# EAGLE design FT232 USB to TTL Converter (EAGLE 9.6.2)
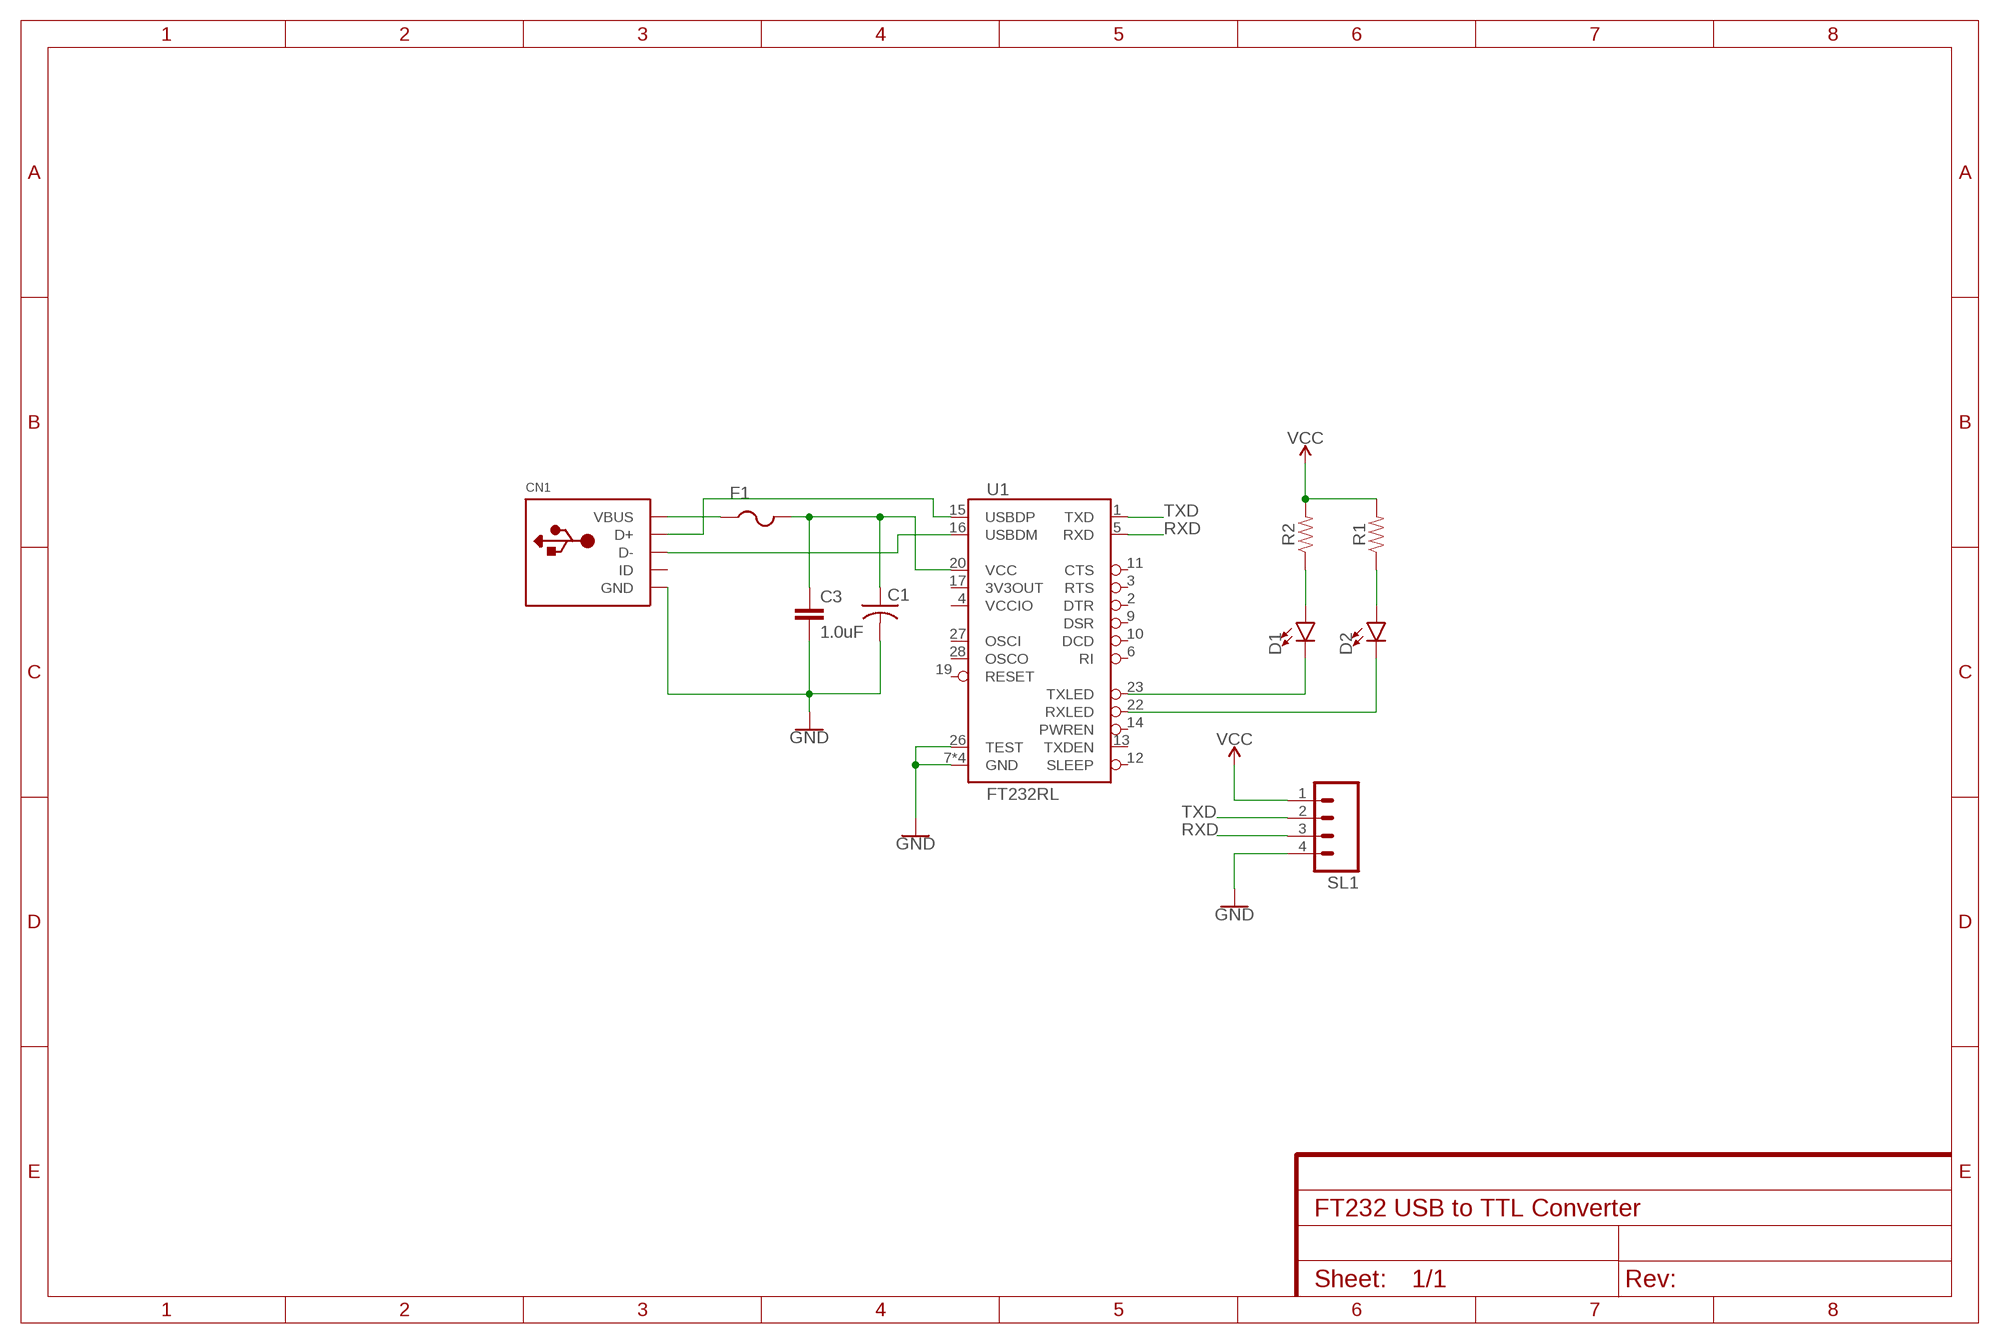
[diagram p0: schematic, sheet 1]

## Parts
C1  C-USC1206  [C1206]
C3  1.0uF  1.0UF-1206-50V-10%  [1206]
CN1  USBMOLEX  [USB-MINIB-THM-MOLEX]
D1  LED1206  [LED-1206]
D2  LED1206  [LED-1206]
F1  PTCFUSE-1206  [R1206]
R1  RESISTOR1206  [1206]
R2  RESISTOR1206  [1206]
SL1  M04  [04P]
U1  FT232RL  FT232RLSSOP  [SSOP28DB]

## Nets
GND: C1.2 C3.2 CN1.GND SL1.4 U1.7(GND) U1.18(GND) U1.21(GND) U1.25(GND) U1.26(TEST)
N$1: CN1.VBUS F1.1
N$2: C1.1 C3.1 F1.2 U1.20(VCC)
N$3: CN1.D+ U1.15(USBDP)
N$4: CN1.D- U1.16(USBDM)
N$5: D1.A R2.1
N$6: D2.A R1.1
N$7: D1.C U1.23(TXLED)
N$8: D2.C U1.22(RXLED)
RXD: SL1.3 U1.5(RXD)
TXD: SL1.2 U1.1(TXD)
VCC: R1.2 R2.2 SL1.1
Unconnected: CN1.ID U1.2(DTR) U1.3(RTS) U1.6(RI) U1.9(DSR) U1.10(DCD) U1.11(CTS) U1.12(SLEEP) U1.13(TXDEN) U1.14(PWREN) U1.17(3V3OUT) U1.19(RESET) U1.27(OSCI) U1.28(OSCO)

## Power pins joined to a net without a drawn wire
VCCIO: U1.4(VCCIO)

## Library data of the parts
C1 = adafruit:C-US: CAPACITOR, American symbol
C3 = SparkFun-Capacitors:1.0UF: 1µF ceramic capacitors A capacitor is a passive two-terminal electrical component used to store electrical energy temporarily in an electric field.; PROD_ID: CAP-09822
CN1 = adafruit:USB: USB Connectors USBMINIB - Surface Mount Female Mini-B USB Connector 4UConnector: 06564 By microbuilder.eu Thru-hole RA Female Mini-B USB Connector 4UConnector: 18732 By ladyada.net
D1 D2 = SparkFun-LED:LED: LED (Generic) Standard schematic elements and footprints for 5mm, 3mm, 1206, and 0603 sized LEDs. Generic LEDs with no color specified.
F1 = adafruit:PTCFUSE: PTC fuses, resettable thermistors
R1 R2 = SparkFun-Resistors:RESISTOR: Generic Resistor Package
SL1 = con-amp-quick:M04: AMP QUICK CONNECTOR; OC_FARNELL: unknown; OC_NEWARK: unknown
U1 = SparkFun-IC-Comms:FT232RL: FT232RL USB UART FT232RL 4th Generation USB UART (USB <-> Serial) Controller. Datasheet <http://www.sparkfun.com/datasheets/IC/FT232R_v104.pdf> SparkFun Products Component <https://www.sparkfun.com/products/650> (COM-00650) SparkFun RedBot Mainboard <https://www.sparkfun.com/products/12097> (ROB-12097) SparkFun FTDI Basic Breakout - 5V <https://www.sparkfun.com/products/9716> (DEV-09716) SparkFun FTDI Basic Breakout - 3.3V <https://www.sparkfun.com/products/9873> (DEV-09873) Bus Pirate - v3.6a <https://www.sparkfun.com/products/12942> (TOL-12942) SparkFun USB to Serial Breakout - FT232RL <https://www.sparkfun.com/products/12731> (BOB-12731) SparkFun PicoBoard <https://www.sparkfun.com/products/11888> (WIG-11888) SparkFun RFID USB Reader <https://www.sparkfun.com/products/9963> (SEN-09963) LilyPad FTDI Basic Breakout - 5V <https://www.sparkfun.com/products/10275> (DEV-10275) SparkFun Stepoko <https://www.sparkfun.com/products/13899> (ROB-13899); PROD_ID: IC-00870

## Board
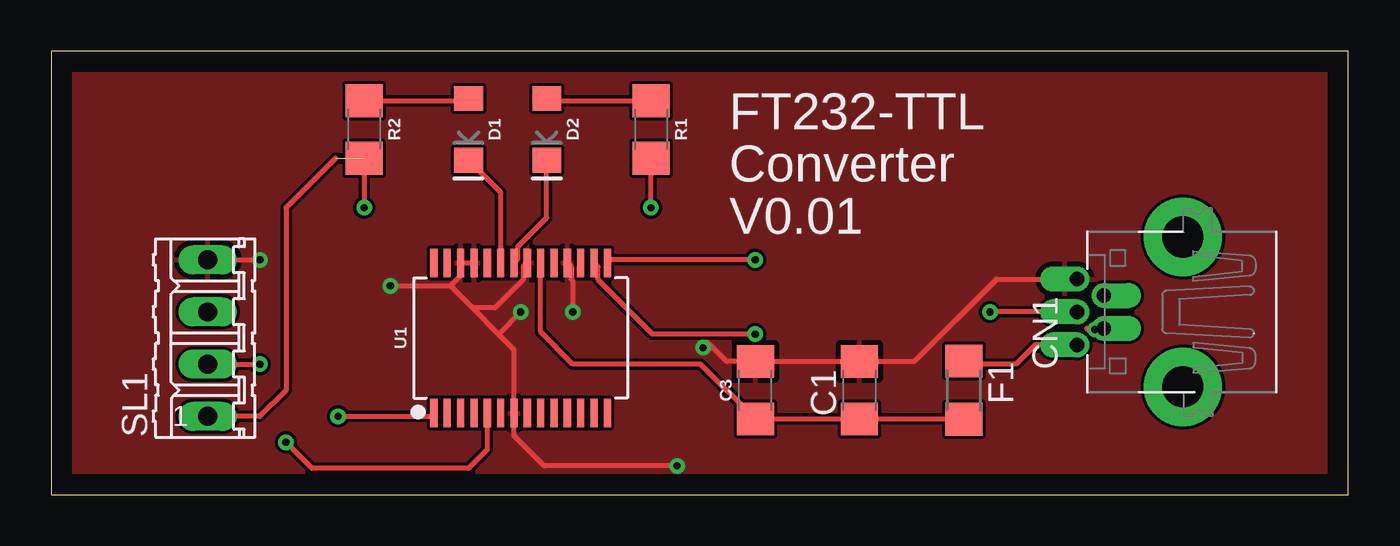
[diagram p1: board, top side]
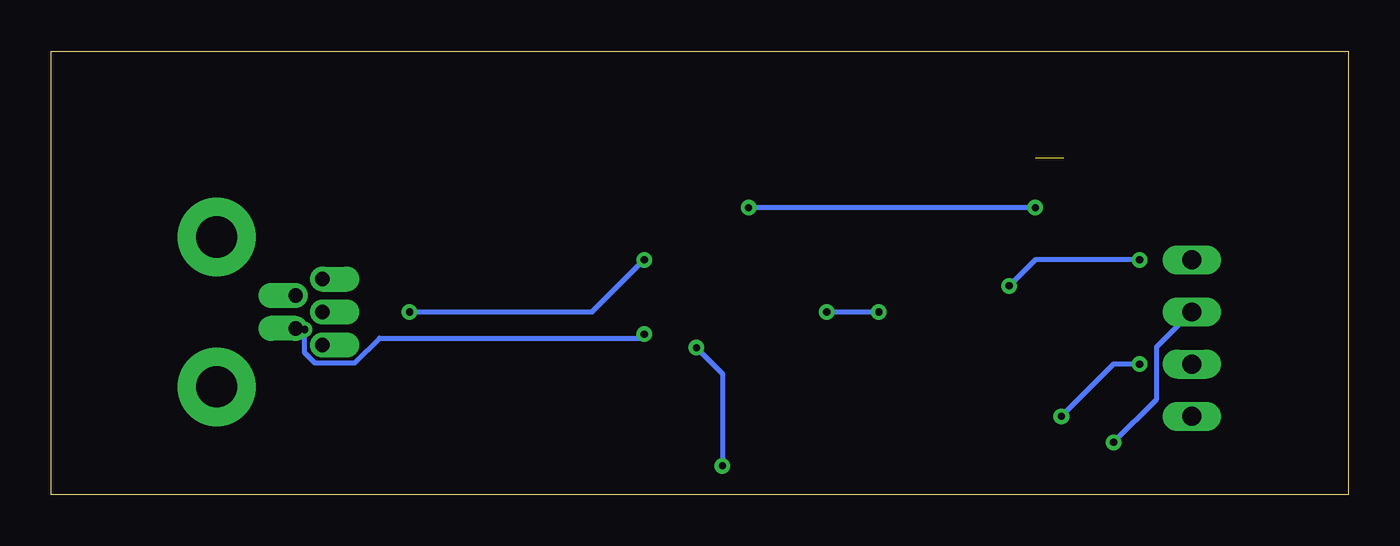
[diagram p2: board, bottom side, seen from below]

Size 63.17 x 21.58 mm. Coordinates in mm from the lower left corner, seen from the top.
Outline: 0,0 63.17,0 63.17,21.58 0,21.58 0,0
Copper layers (1*16): Top 0.035mm / dielectric 1.5mm / Bottom 0.035mm
Design rules "default": minimum track width 6mil, minimum drill 0.35mm, track to track 6mil, track to pad 6mil, pad to pad 6mil, via to via 6mil, smd to smd 6mil, copper to edge 40mil, drill to drill 6mil, minimum pad ring 10mil, minimum via ring 8mil, stop-mask expansion 4mil, vias tented up to drill 0mil, thermal gap 10mil

### Footprints (pad centres in the part's own frame; a part is rotated, then mirrored left to right if it is on the bottom)
C1206 = smd 1.6 x 1.8: 1 -1.4,0; 2 1.4,0
1206 = smd 1.6 x 1.8: 1 -1.4,0; 2 1.4,0
USB-MINIB-THM-MOLEX = drill 0.7 offset: D+ 0,9.72; D- -0.8,8.42; GND 1.6,9.72; ID 0.8,8.42; VBUS -1.6,9.72 | drill 2 pad 3.81: GND1 -3.65,4.57; GND4 3.65,4.57
LED-1206 = smd 1.2 x 1.4: A -1.5,0; C 1.5,0
R1206 = smd 1.6 x 1.803: 1 -1.422,0; 2 1.422,0
04P = drill 0.914 long: 1 -3.81,0; 2 -1.27,0; 3 1.27,0; 4 3.81,0
SSOP28DB = smd 0.348 x 1.397: 1 -4.225,-3.656; 2 -3.575,-3.656; 3 -2.925,-3.656; 4 -2.275,-3.656; 5 -1.625,-3.656; 6 -0.975,-3.656; 7 -0.325,-3.656; 8 0.325,-3.656; 9 0.975,-3.656; 10 1.625,-3.656; 11 2.275,-3.656; 12 2.925,-3.656; 13 3.575,-3.656; 14 4.225,-3.656; 15 4.225,3.656; 16 3.575,3.656; 17 2.925,3.656; 18 2.275,3.656; 19 1.625,3.656; 20 0.975,3.656; 21 0.325,3.656; 22 -0.325,3.656; 23 -0.975,3.656; 24 -1.625,3.656; 25 -2.275,3.656; 26 -2.925,3.656; 27 -3.575,3.656; 28 -4.225,3.656

### Placement (x,y rotation side)
C1  39.37,5.08 90 top
C3  34.29,5.08 90 top
CN1  59.69,8.89 90 top
D1  20.32,17.78 270 top
D2  24.13,17.78 270 top
F1  44.45,5.08 270 top
R1  29.21,17.78 270 top
R2  15.24,17.78 270 top
SL1  7.62,7.62 90 top
U1  22.86,7.62 0 top

### Tracks (layer width: path | path; a pad name or v marks a point on that pad's centre or on a via)
GND  (via drill 0.35)
  Top 0.254: SL1.4 v10.16,11.43 | 19.44,10.16 19.93,10.66 U1.26 U1.25 | v16.51,10.16 19.44,10.16 | 21.78,7.81 22.54,7.06 U1.7 22.54,2.87 24.01,1.39 v30.48,1.39 | 21.78,7.81 20.51,9.08 | 20.51,9.08 19.44,10.16 | CN1.GND 46.05,10.49 42.04,6.48 C1.2 C3.2 32.89,6.48 31.97,7.4 31.75,7.4 v31.75,7.15 | U1.21 22.99,11.08 22.99,10.46 21.61,9.08 20.51,9.08 | U1.18 25.33,11.08 25.33,10.46 25.4,10.39 v25.4,8.89 | v22.86,8.89 21.78,7.81
  Bottom 0.254: v10.16,11.43 15.24,11.43 v16.51,10.16 | v31.75,7.15 30.48,5.88 v30.48,1.39 30.48,1.27 | v25.4,8.89 v22.86,8.89
  pour Top: 63.5,21.59 63.5,0 0,0 0,21.59
N$1
  Top 0.254: CN1.VBUS 47.93,7.29 46.99,6.35 44.6,6.35 F1.1
N$2
  Top 0.254: F1.2 44.43,3.68 C1.1 C3.1 31.62,6.35 25.4,6.35 23.83,7.91 U1.20
N$3  (via drill 0.35)
  Top 0.254: CN1.D+ v45.72,8.89 | v34.29,11.43 27.24,11.43 U1.15
  Bottom 0.254: v45.72,8.89 36.83,8.89 v34.29,11.43
N$4  (via drill 0.35)
  Top 0.254: CN1.D- 50.42,8.09 50.48,8.03 v50.83,8.03 | v34.29,7.81 29.28,7.81 26.63,10.46 26.63,11.08 U1.16
  Bottom 0.254: v50.83,8.03 50.83,7.68 50.85,7.66 50.85,6.92 50.34,6.41 48.4,6.41 47.18,7.62 34.29,7.62 v34.29,7.81
N$5
  Top 0.254: R2.1 20.22,19.18 D1.A
N$6
  Top 0.254: D2.A 24.23,19.18 R1.1
N$7
  Top 0.254: D1.C 21.89,14.71 U1.23
N$8
  Top 0.254: U1.22 22.73,11.47 22.73,12.09 24.13,13.49 D2.C
RXD  (via drill 0.35)
  Top 0.254: U1.5 21.24,2.19 20.32,1.27 12.7,1.27 v11.43,2.54
  Bottom 0.254: SL1.3 9.32,7.19 9.32,4.65 v11.43,2.54
TXD  (via drill 0.35)
  Top 0.254: SL1.2 v10.16,6.35 | v13.97,3.81 18.48,3.81 U1.1
  Bottom 0.254: v10.16,6.35 11.43,6.35 v13.97,3.81
VCC  (via drill 0.35)  (1 unrouted)
  Top 0.254: SL1.1 10.16,3.81 11.43,5.08 11.43,13.97 13.84,16.38 | R2.2 v15.24,13.97 | v29.21,13.97 R1.2
  Bottom 0.254: v15.24,13.97 v29.21,13.97

### Text on the board
tPlace: FT232-TTL | Converter | V0.01